# Altium schematic sheet MotorDriver.SchDoc
size A
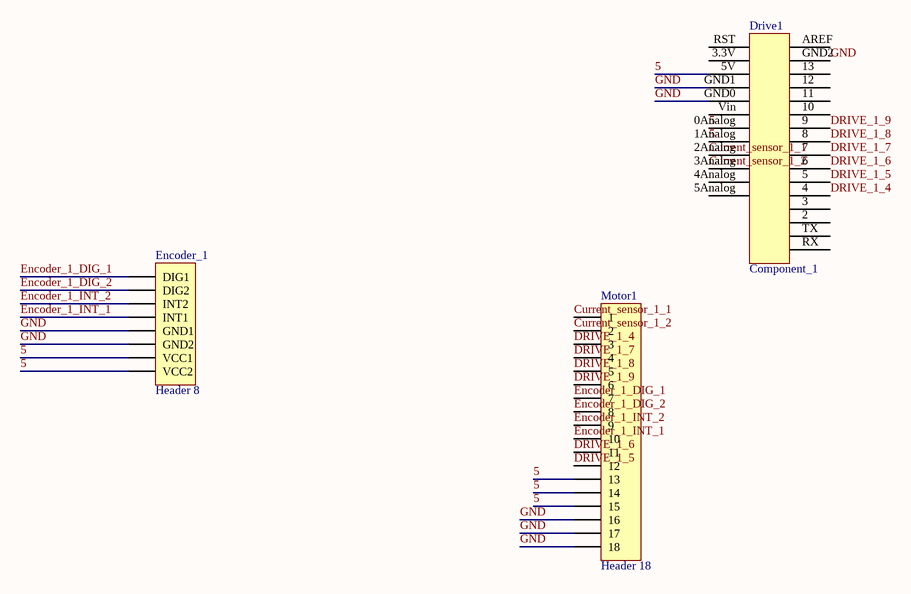
[diagram p0: MotorDriver.SchDoc]

## Parts
Drive1  Component_1  [PCBComponent_1]
Encoder_1  Header 8  [HDR1X8]
Motor1  Header 18  [HDR1X18]

## Nets
5: Drive1.0Analog Drive1.1Analog Drive1.5V Encoder_1.7(VCC1) Encoder_1.8(VCC2) Motor1.13 Motor1.14 Motor1.15
Current_sensor_1_1: Drive1.2Analog Motor1.1
Current_sensor_1_2: Drive1.3Analog Motor1.2
DRIVE_1_4: Drive1.4 Motor1.3
DRIVE_1_5: Drive1.5 Motor1.12
DRIVE_1_6: Drive1.6 Motor1.11
DRIVE_1_7: Drive1.7 Motor1.4
DRIVE_1_8: Drive1.8 Motor1.5
DRIVE_1_9: Drive1.9 Motor1.6
Encoder_1_DIG_1: Encoder_1.1(DIG1) Motor1.7
Encoder_1_DIG_2: Encoder_1.2(DIG2) Motor1.8
Encoder_1_INT_1: Encoder_1.4(INT1) Motor1.10
Encoder_1_INT_2: Encoder_1.3(INT2) Motor1.9
GND: Drive1.GND0 Drive1.GND1 Drive1.GND2 Encoder_1.5(GND1) Encoder_1.6(GND2) Motor1.16 Motor1.17 Motor1.18

Not connected (* = marked no-connect by the designer): Drive1 2 3 3.3V 4Analog 5Analog 10 11 12 13 AREF RST RX TX Vin

## Library data of the parts
Encoder_1 = Header 8: Header, 8-Pin; LatestRevisionDate: 17-Jul-2002; LatestRevisionNote: Re-released for DXP Platform.; Publisher: Altium Limited
Motor1 = Header 18: Header, 18-Pin; LatestRevisionDate: 17-Jul-2002; LatestRevisionNote: Re-released for DXP Platform.; Publisher: Altium Limited